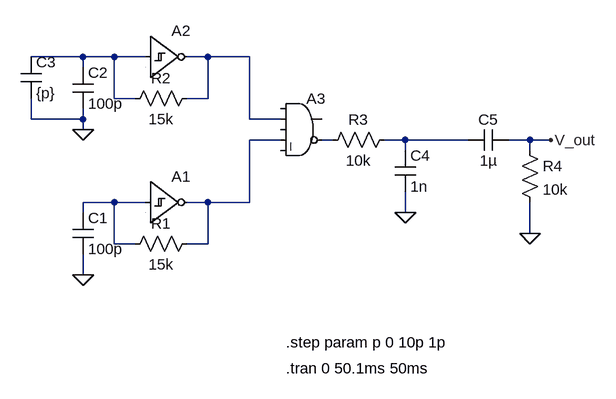
[diagram p0: schematic draft1.asc]
draft1.asc, the LTspice schematic file:
Version 4
SHEET 1 904 756
WIRE 16 0 -64 0
WIRE 64 0 16 0
WIRE 112 0 64 0
WIRE 208 0 176 0
WIRE 272 0 208 0
WIRE 16 16 16 0
WIRE 64 64 64 0
WIRE 96 64 64 64
WIRE 208 64 208 0
WIRE 208 64 176 64
WIRE -64 96 -64 64
WIRE 16 96 16 80
WIRE 16 96 -64 96
WIRE 272 96 272 0
WIRE 320 96 272 96
WIRE 16 112 16 96
WIRE 320 128 272 128
WIRE 400 128 384 128
WIRE 512 128 480 128
WIRE 608 128 512 128
WIRE 704 128 672 128
WIRE 736 128 704 128
WIRE 512 144 512 128
WIRE 704 144 704 128
WIRE 64 224 16 224
WIRE 112 224 64 224
WIRE 208 224 176 224
WIRE 272 224 272 128
WIRE 272 224 208 224
WIRE 16 240 16 224
WIRE 512 240 512 208
WIRE 704 272 704 224
WIRE 64 288 64 224
WIRE 96 288 64 288
WIRE 208 288 208 224
WIRE 208 288 176 288
WIRE 16 336 16 304
FLAG 16 336 0
FLAG 16 112 0
FLAG 512 240 0
FLAG 736 128 V_out
FLAG 704 272 0
SYMBOL Digital\\schmtinv 112 160 R0
WINDOW 3 -71 111 Invisible 0
SYMATTR Value Vhigh=3, Vt=1.35, Vh=0.3, trise=20n, tfall=20n
SYMATTR InstName A1
SYMBOL res 192 272 R90
WINDOW 0 0 56 VBottom 0
WINDOW 3 32 56 VTop 0
SYMATTR InstName R1
SYMATTR Value 15k
SYMBOL cap 0 240 R0
SYMATTR InstName C1
SYMATTR Value 100p
SYMBOL Digital\\schmtinv 112 -64 R0
WINDOW 3 -71 111 Invisible 0
SYMATTR Value Vhigh=3, Vt=1.35, Vh=0.3, trise=20n, tfall=20n
SYMATTR InstName A2
SYMBOL res 192 48 R90
WINDOW 0 0 56 VBottom 0
WINDOW 3 32 56 VTop 0
SYMATTR InstName R2
SYMATTR Value 15k
SYMBOL cap 0 16 R0
SYMATTR InstName C2
SYMATTR Value 100p
SYMBOL cap -80 0 R0
SYMATTR InstName C3
SYMATTR Value {p}
SYMBOL Digital\\and 352 48 R0
WINDOW 3 16 52 Invisible 0
SYMATTR InstName A3
SYMATTR Value trise=20n, tfall=20n, Vt=1.35, Vhigh=3
SYMBOL res 496 112 R90
WINDOW 0 0 56 VBottom 0
WINDOW 3 32 56 VTop 0
SYMATTR InstName R3
SYMATTR Value 10k
SYMBOL cap 496 144 R0
SYMATTR InstName C4
SYMATTR Value 1n
SYMBOL cap 672 112 R90
WINDOW 0 0 32 VBottom 0
WINDOW 3 32 32 VTop 0
SYMATTR InstName C5
SYMATTR Value 1µ
SYMBOL res 688 128 R0
SYMATTR InstName R4
SYMATTR Value 10k
TEXT 328 480 Left 0 !.tran 0 50.1ms 50ms
TEXT 328 440 Left 0 !.step param p 0 10p 1p

The netlist it stands for:
* draft1.asc
A1 N006 0 0 0 0 N003 0 0 SCHMITT Vhigh=3, Vt=1.35, Vh=0.3, trise=20n, tfall=20n
R1 N003 N006 15k
C1 N006 0 100p
A2 N001 0 0 0 0 N002 0 0 SCHMITT Vhigh=3, Vt=1.35, Vh=0.3, trise=20n, tfall=20n
R2 N002 N001 15k
C2 N001 0 100p
C3 N001 0 {p}
A3 0 N002 0 N003 0 N004 0 0 AND trise=20n, tfall=20n, Vt=1.35, Vhigh=3
R3 N005 N004 10k
C4 N005 0 1n
C5 V_out N005 1µ
R4 V_out 0 10k
.tran 0 50.1ms 50ms
.step param p 0 10p 1p
.backanno
.end